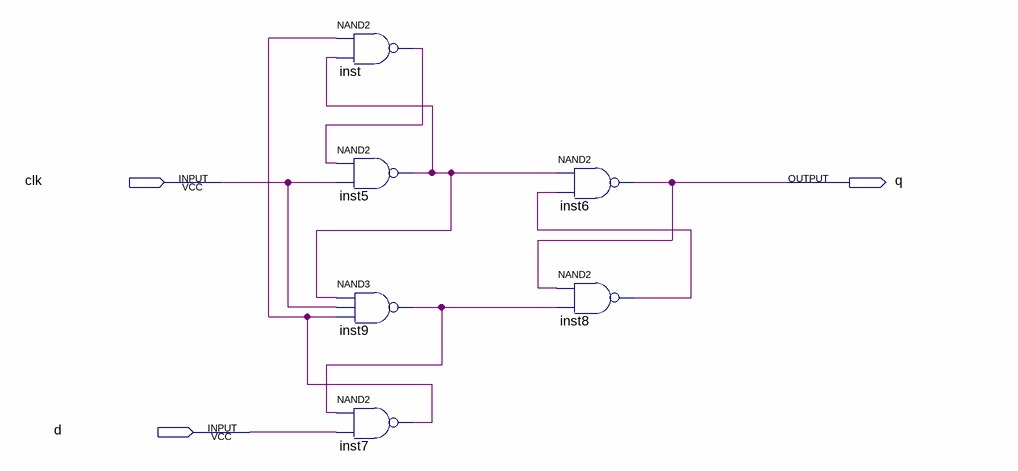
[diagram p0: schematic sheet]
// Quartus schematic D_TR.bdf as structural Verilog: 6 symbols, 3 pins
module D_TR (
  input  clk,
  input  d,
  output q
);

  wire inst5_out, inst7_out, inst8_out, inst9_out, inst_out;

  nand inst (inst_out, inst7_out, inst5_out);
  nand inst5 (inst5_out, inst_out, clk);
  nand inst9 (inst9_out, inst5_out, clk, inst7_out);
  nand inst7 (inst7_out, inst9_out, d);
  nand inst6 (q, inst5_out, inst8_out);
  nand inst8 (inst8_out, q, inst9_out);
endmodule
